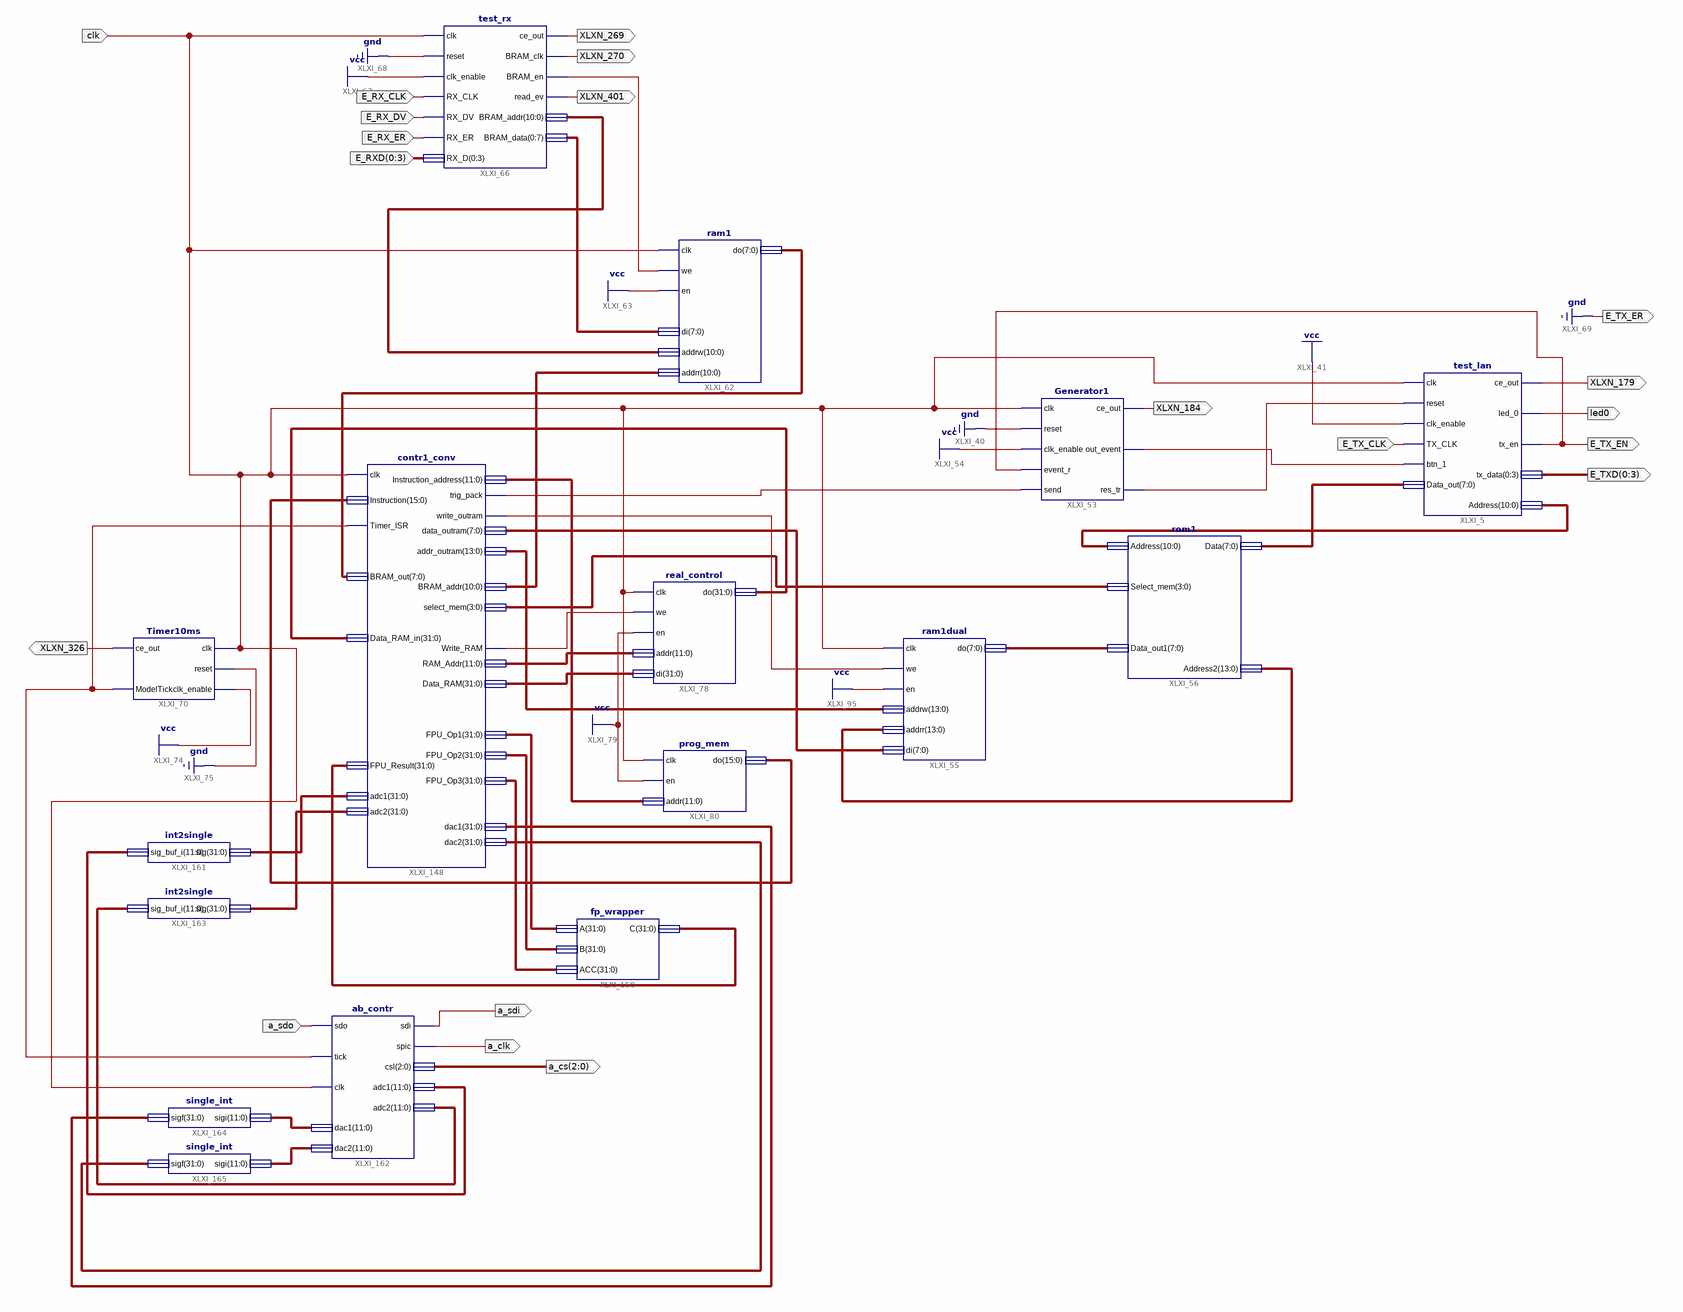
[diagram p0: schematic sheet 1]
// Xilinx ISE schematic Top_Module.sch (spartan3e) as structural Verilog: 16 symbols, 20 ports
module Top_Module (
  input  E_TX_CLK,
  input  [0:3] E_RXD,
  input  E_RX_ER,
  input  E_RX_DV,
  input  E_RX_CLK,
  input  clk,
  input  a_sdo,
  output [0:3] E_TXD,
  output led0,
  output XLXN_179,
  output E_TX_EN,
  output XLXN_184,
  output XLXN_269,
  output XLXN_270,
  output E_TX_ER,
  output XLXN_401,
  output XLXN_326,
  output [2:0] a_cs,
  output a_clk,
  output a_sdi
);

  wire XLXN_182, XLXN_183, XLXN_271, XLXN_706, XLXN_708, XLXN_739, XLXN_805;
  wire [3:0] XLXN_736;
  wire [7:0] XLXN_201, XLXN_276, XLXN_740, XLXN_743, XLXN_753;
  wire [10:0] XLXN_242, XLXN_272, XLXN_737;
  wire [11:0] XLXN_705, XLXN_709, XLXN_810, XLXN_812, XLXN_814, XLXN_815;
  wire [13:0] XLXN_741, XLXN_751;
  wire [15:0] XLXN_718;
  wire [31:0] XLXN_710, XLXN_734, XLXN_760, XLXN_761, XLXN_762, XLXN_763, XLXN_786, XLXN_787, XLXN_807,
       XLXN_808;

  test_lan XLXI_5 (
    .clk(clk), .reset(XLXN_183), .clk_enable(1'b1), .TX_CLK(E_TX_CLK), .btn_1(XLXN_182), .Data_out(XLXN_201),
    .ce_out(XLXN_179), .led_0(led0), .tx_en(E_TX_EN), .tx_data(E_TXD), .Address(XLXN_242));
  Generator1 XLXI_53 (
    .clk(clk), .reset(1'b0), .clk_enable(1'b1), .event_r(E_TX_EN), .send(XLXN_706), .ce_out(XLXN_184),
    .out_event(XLXN_182), .res_tr(XLXN_183));
  rom1 XLXI_56 (.Address(XLXN_242), .Select_mem(XLXN_736), .Data_out1(XLXN_753), .Data(XLXN_201), .Address2(XLXN_751));
  ram1dual XLXI_55 (
    .clk(clk), .we(XLXN_739), .en(1'b1), .addrw(XLXN_741), .addrr(XLXN_751), .di(XLXN_740), .\do (XLXN_753));
  ram1 XLXI_62 (
    .clk(clk), .we(XLXN_271), .en(1'b1),
    .di({XLXN_276[0], XLXN_276[1], XLXN_276[2], XLXN_276[3], XLXN_276[4], XLXN_276[5], XLXN_276[6], XLXN_276[7]}),
    .\do (XLXN_743), .addrw(XLXN_272), .addrr(XLXN_737));
  test_rx XLXI_66 (
    .clk(clk), .reset(1'b0), .clk_enable(1'b1), .RX_CLK(E_RX_CLK), .RX_DV(E_RX_DV), .RX_ER(E_RX_ER),
    .RX_D(E_RXD), .ce_out(XLXN_269), .BRAM_clk(XLXN_270), .BRAM_en(XLXN_271), .read_ev(XLXN_401),
    .BRAM_addr(XLXN_272),
    .BRAM_data({XLXN_276[0], XLXN_276[1], XLXN_276[2], XLXN_276[3], XLXN_276[4], XLXN_276[5], XLXN_276[6], XLXN_276[7]}));
  contr1_conv XLXI_148 (
    .clk(clk), .Timer_ISR(XLXN_805), .Instruction(XLXN_718), .Data_RAM_in(XLXN_734), .FPU_Result(XLXN_762),
    .BRAM_out(XLXN_743), .adc1(XLXN_807), .adc2(XLXN_808), .Write_RAM(XLXN_708), .trig_pack(XLXN_706),
    .write_outram(XLXN_739), .Instruction_address(XLXN_705), .RAM_Addr(XLXN_709), .Data_RAM(XLXN_710),
    .FPU_Op1(XLXN_760), .FPU_Op2(XLXN_761), .FPU_Op3(XLXN_763), .BRAM_addr(XLXN_737), .select_mem(XLXN_736),
    .data_outram(XLXN_740), .addr_outram(XLXN_741), .dac1(XLXN_786), .dac2(XLXN_787));
  real_control XLXI_78 (.clk(clk), .we(XLXN_708), .en(1'b1), .addr(XLXN_709), .di(XLXN_710), .\do (XLXN_734));
  prog_mem XLXI_80 (.clk(clk), .en(1'b1), .addr(XLXN_705), .\do (XLXN_718));
  Timer10ms XLXI_70 (.clk(clk), .reset(1'b0), .clk_enable(1'b1), .ce_out(XLXN_326), .ModelTick(XLXN_805));
  fp_wrapper XLXI_150 (.A(XLXN_760), .B(XLXN_761), .C(XLXN_762), .ACC(XLXN_763));
  int2single XLXI_161 (.sig_buf_i(XLXN_812), .sig(XLXN_807));
  ab_contr XLXI_162 (
    .sdo(a_sdo), .tick(XLXN_805), .clk(clk), .sdi(a_sdi), .spic(a_clk), .csl(a_cs), .adc1(XLXN_812),
    .adc2(XLXN_810), .dac1(XLXN_814), .dac2(XLXN_815));
  int2single XLXI_163 (.sig_buf_i(XLXN_810), .sig(XLXN_808));
  single_int XLXI_164 (.sigf(XLXN_786), .sigi(XLXN_814));
  single_int XLXI_165 (.sigf(XLXN_787), .sigi(XLXN_815));

  assign E_TX_ER = 1'b0;
endmodule
